# Altium schematic sheet power.SchDoc: Edison Gateway - Power
size Letter; Author: Ye-Sheng Kuo; DocumentNumber: 2; Revision: 3; SheetNumber: 2; SheetTotal: 10
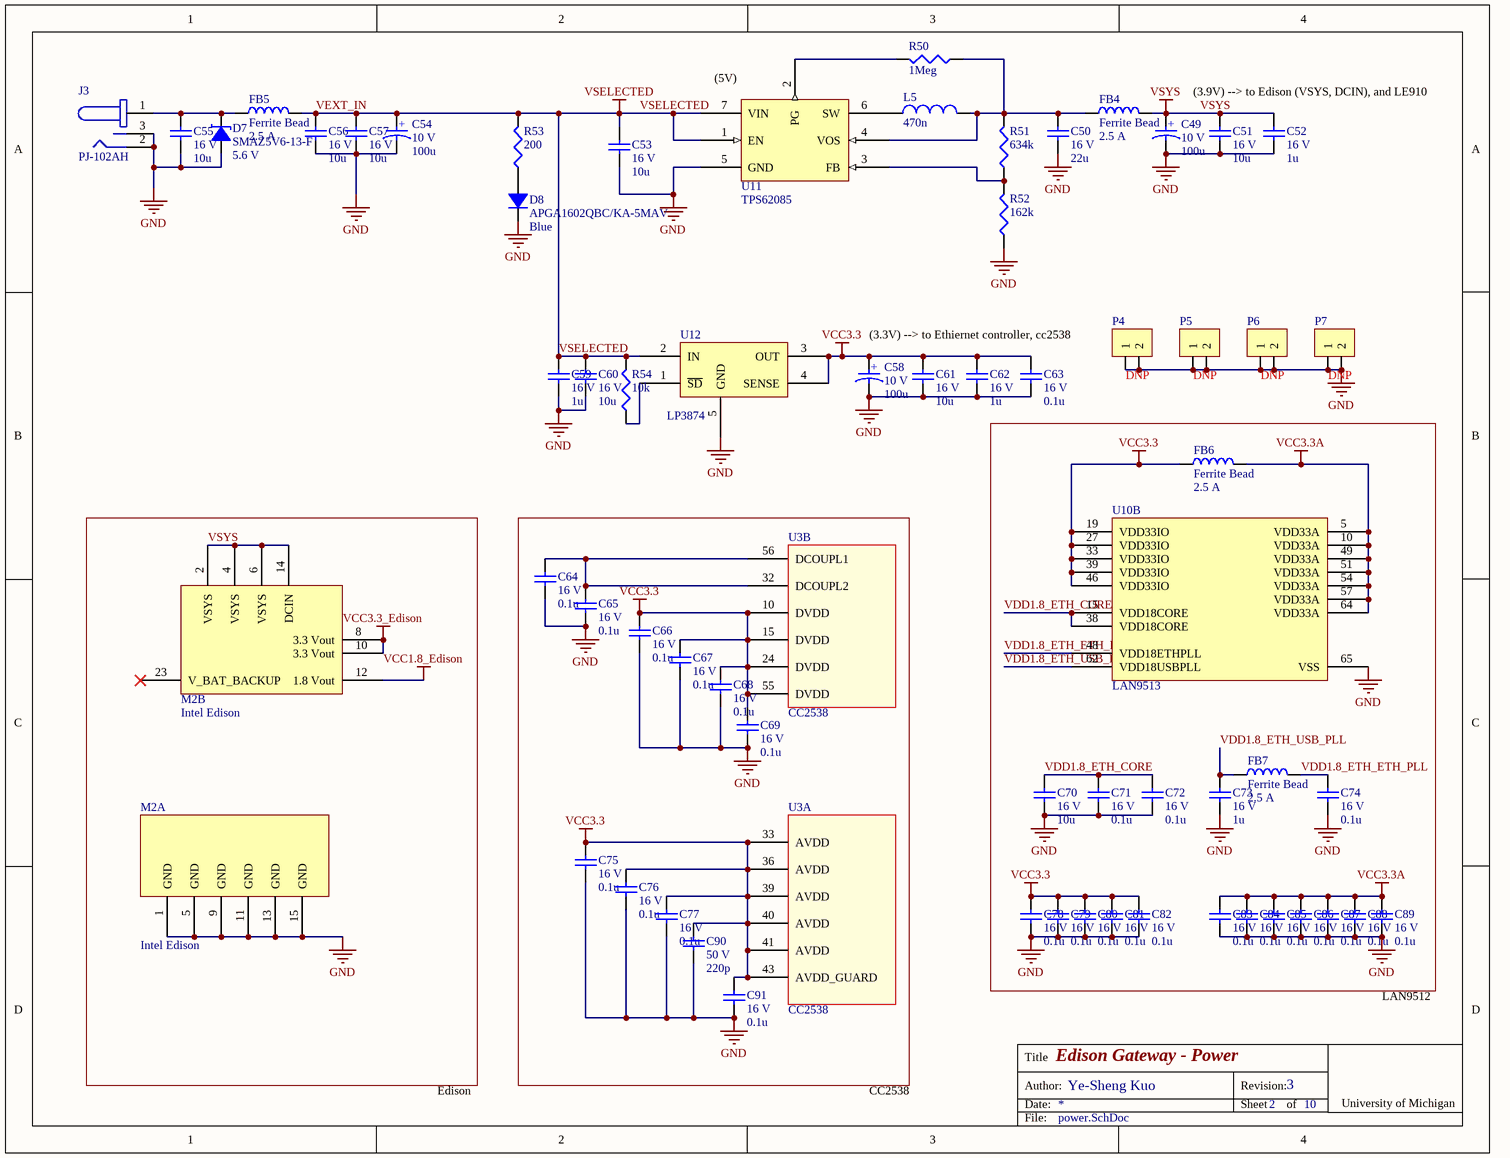
[diagram p0: power.SchDoc]

## Parts
C49  voltage rated: 10 V  [1206 - POLAR MARKING]  (hidden comment: 100u)
C50  voltage rated: 16 V  [1206]  (hidden comment: 22u)
C51  voltage rated: 16 V  [0603]  (hidden comment: 10u)
C52  voltage rated: 16 V  [0402]  (hidden comment: 1u)
C53  voltage rated: 16 V  [0603]  (hidden comment: 10u)
C54  voltage rated: 10 V  [1206 - POLAR MARKING]  (hidden comment: 100u)
C55  voltage rated: 16 V  [0603]  (hidden comment: 10u)
C56  voltage rated: 16 V  [0603]  (hidden comment: 10u)
C57  voltage rated: 16 V  [0603]  (hidden comment: 10u)
C58  voltage rated: 10 V  [1206 - POLAR MARKING]  (hidden comment: 100u)
C59  voltage rated: 16 V  [0402]  (hidden comment: 1u)
C60  voltage rated: 16 V  [0603]  (hidden comment: 10u)
C61  voltage rated: 16 V  [0603]  (hidden comment: 10u)
C62  voltage rated: 16 V  [0402]  (hidden comment: 1u)
C63  voltage rated: 16 V  [0402]  (hidden comment: 0.1u)
C64  voltage rated: 16 V  [0402]  (hidden comment: 0.1u)
C65  voltage rated: 16 V  [0402]  (hidden comment: 0.1u)
C66  voltage rated: 16 V  [0402]  (hidden comment: 0.1u)
C67  voltage rated: 16 V  [0402]  (hidden comment: 0.1u)
C68  voltage rated: 16 V  [0402]  (hidden comment: 0.1u)
C69  voltage rated: 16 V  [0402]  (hidden comment: 0.1u)
C70  voltage rated: 16 V  [0603]  (hidden comment: 10u)
C71  voltage rated: 16 V  [0402]  (hidden comment: 0.1u)
C72  voltage rated: 16 V  [0402]  (hidden comment: 0.1u)
C73  voltage rated: 16 V  [0402]  (hidden comment: 1u)
C74  voltage rated: 16 V  [0402]  (hidden comment: 0.1u)
C75  voltage rated: 16 V  [0402]  (hidden comment: 0.1u)
C76  voltage rated: 16 V  [0402]  (hidden comment: 0.1u)
C77  voltage rated: 16 V  [0402]  (hidden comment: 0.1u)
C78  voltage rated: 16 V  [0402]  (hidden comment: 0.1u)
C79  voltage rated: 16 V  [0402]  (hidden comment: 0.1u)
C80  voltage rated: 16 V  [0402]  (hidden comment: 0.1u)
C81  voltage rated: 16 V  [0402]  (hidden comment: 0.1u)
C82  voltage rated: 16 V  [0402]  (hidden comment: 0.1u)
C83  voltage rated: 16 V  [0402]  (hidden comment: 0.1u)
C84  voltage rated: 16 V  [0402]  (hidden comment: 0.1u)
C85  voltage rated: 16 V  [0402]  (hidden comment: 0.1u)
C86  voltage rated: 16 V  [0402]  (hidden comment: 0.1u)
C87  voltage rated: 16 V  [0402]  (hidden comment: 0.1u)
C88  voltage rated: 16 V  [0402]  (hidden comment: 0.1u)
C89  voltage rated: 16 V  [0402]  (hidden comment: 0.1u)
C90  voltage rated: 50 V  [0402]  (hidden comment: 220p)
C91  voltage rated: 16 V  [0402]  (hidden comment: 0.1u)
D7  SMAZ5V6-13-F  Zener Voltage: 5.6 V  [SMAZ5V1]
D8  APGA1602QBC/KA-5MAV  value Blue  [APGA1602]
FB4  Ferrite Bead  Current Rating (Max): 2.5 A  [0603]
FB5  Ferrite Bead  Current Rating (Max): 2.5 A  [0603]
FB6  Ferrite Bead  Current Rating (Max): 2.5 A  [0603]
FB7  Ferrite Bead  Current Rating (Max): 2.5 A  [0603]
J3  PJ-102AH  [PJ-102AH]
L5  470n  [74404300047]
M2  Intel Edison  [Intel Edison mating]  (parts A,B of 5)
P4  Note: DNP  [1x2 header]  (hidden comment: 1 x 2 header)
P5  Note: DNP  [1x2 header]  (hidden comment: 1 x 2 header)
P6  Note: DNP  [1x2 header]  (hidden comment: 1 x 2 header)
P7  Note: DNP  [1x2 header]  (hidden comment: 1 x 2 header)
R50  1Meg  [0402]
R51  634k  [0402]
R52  162k  [0402]
R53  200  [0402]
R54  10k  [0402]
U3  CC2538  [QFN56]  (parts A,B of 6)
U10  LAN9513  [QFN-64]  (part B of 5)
U11  TPS62085  [VSON]
U12  LP3874  [SOT150P700X180-5N]

## Nets
GND: C49.2 C50.2 C51.2 C52.2 C53.2 C54.2 C55.2 C56.2 C57.2 C58.2 C59.2 C60.2 C61.2 C62.2 C63.2 C64.2 C65.2 C66.2 C67.2 C68.2 C69.2 C70.2 C71.2 C72.2 C73.2 C74.2 C75.2 C76.2 C77.2 C78.2 C79.2 C80.2 C81.2 C82.2 C83.2 C84.2 C85.2 C86.2 C87.2 C88.2 C89.2 C90.2 C91.2 D7.1 D8.2 J3.2 J3.3 M2.1(GND) M2.5(GND) M2.9(GND) M2.11(GND) M2.13(GND) M2.15(GND) P4.1 P4.2 P5.1 P5.2 P6.1 P6.2 P7.1 P7.2 R52.2 U10.65(VSS) U11.5(GND) U12.5(GND)
VCC1.8_Edison: M2.12(1.8_Vout)
VCC3.3: C58.1 C61.1 C62.1 C63.1 C66.1 C67.1 C68.1 C69.1 C75.1 C76.1 C77.1 C78.1 C79.1 C80.1 C81.1 C82.1 C90.1 C91.1 FB6.2 U3.10(DVDD) U3.15(DVDD) U3.24(DVDD) U3.33(AVDD) U3.36(AVDD) U3.39(AVDD) U3.40(AVDD) U3.41(AVDD) U3.43(AVDD_GUARD) U3.55(DVDD) U10.19(VDD33IO) U10.27(VDD33IO) U10.33(VDD33IO) U10.39(VDD33IO) U10.46(VDD33IO) U12.3(OUT) U12.4(SENSE)
VCC3.3_Edison: M2.8(3.3_Vout) M2.10(3.3_Vout)
VCC3.3A: C83.1 C84.1 C85.1 C86.1 C87.1 C88.1 C89.1 FB6.1 U10.5(VDD33A) U10.10(VDD33A) U10.49(VDD33A) U10.51(VDD33A) U10.54(VDD33A) U10.57(VDD33A) U10.64(VDD33A)
VEXT_IN: C53.1 C54.1 C56.1 C57.1 C59.1 C60.1 FB5.1 R53.1 R54.1 U11.1(EN) U11.7(VIN) U12.2(IN)  [also labelled VSELECTED]
VSYS: C49.1 C51.1 C52.1 FB4.1 M2.2(VSYS) M2.4(VSYS) M2.6(VSYS) M2.14(DCIN)
VDD1.8_ETH_CORE: C70.1 C71.1 C72.1 U10.15(VDD18CORE) U10.38(VDD18CORE)
VDD1.8_ETH_ETH_PLL: C74.1 FB7.1 U10.48(VDD18ETHPLL)
VDD1.8_ETH_USB_PLL: C73.1 FB7.2 U10.62(VDD18USBPLL)
NetC50_1: C50.1 FB4.2 L5.1 R50.2 R51.1 U11.4(VOS)
NetC55_1: C55.1 D7.2 FB5.2 J3.1
NetC64_1: C64.1 C65.1 U3.32(DCOUPL2) U3.56(DCOUPL1)
NetD8_1: D8.1 R53.2
NetL5_2: L5.2 U11.6(SW)
NetR50_1: R50.1 U11.2(PG)
NetR51_2: R51.2 R52.1 U11.3(FB)
NetR54_2: R54.2 U12.1(~{SD})

Not connected (* = marked no-connect by the designer): M2 23(V_BAT_BACKUP)*

## Notes on the sheet
- (near U11) (5V)
- (3.9V) --> to Edison (VSYS, DCIN), and LE910
- (near P4) (3.3V) --> to Ethiernet controller, cc2538
- LAN9512
- Edison
- CC2538
- Title
- Date:
- Author:
- Revision:
- Sheet
- of
- University of Michigan
- File:
- (in symbol TLNK107M010R2500) +

## Library data of the parts
C49 C54 C58 = TLNK107M010R2500: 100µF ±20% Molded Tantalum Capacitors 10V 1206; Manufacture: AVX; ESR: 2.5 Ohm; tolerance: 20%; package: 1206; Supplier 1: Digi-Key; Supplier Part Number 1: 478-6251-1-ND; Value: 100u; Manufacturer Part Number: TLNK107M010R2500
C50 = CL31A226MOCLNNC: 22µF ±20% 16V Ceramic Capacitor X5R 1206; Manufacture: Samsung; tolerance: 20%; package: 1206; Supplier 1: Digi-Key; Supplier Part Number 1: 1276-2728-1-ND; Value: 22u; Temperature Coefficient: X5R; Manufacturer Part Number: CL31A226MOCLNNC
C51 C53 C55-C57 C60 C61 C70 = GRM188C81C106MA73D: 10µF ±20% 16V Ceramic Capacitor X6S 0603; Manufacture: Murata; tolerance: 20%; package: 0603; Temperature Coefficient: X6S; Supplier 1: Digi-Key; Supplier Part Number 1: 490-7198-1-ND; Value: 10u; Manufacturer Part Number: GRM188C81C106MA73D
C52 C59 C62 C73 = C1005X6S1C105K050BC: 1µF ±10% 16V Ceramic Capacitor X6S 0402; Manufacture: TDK; tolerance: 10%; package: 0402; Supplier 1: Digi-Key; Supplier Part Number 1: 445-9086-1-ND; Value: 1u; Temperature Coefficient: X6S; Manufacturer Part Number: C1005X6S1C105K050BC
C63-C69 C71 C72 C74-C89 C91 = GRM155R71C104KA88D: 0.10µF ±10% 16V Ceramic Capacitor X7R 0402; Manufacture: Murata; tolerance: 10%; package: 0402; Supplier 1: Digi-Key; Supplier Part Number 1: 490-3261-1-ND; Value: 0.1u; Temperature Coefficient: X7R; Manufacturer Part Number: GRM155R71C104KA88D
C90 = C0402C221K5RACTU: 220pF ±10% 50V Ceramic Capacitor X7R 0402; Manufacture: Kemet; tolerance: 10%; package: 0402; Supplier 1: Digi-Key; Supplier Part Number 1: 399-1030-1-ND; Value: 220p; Temperature Coefficient: X7R; Manufacturer Part Number: C0402C221K5RACTU
D7 = SMAZ5V6-13-F: Zener Diode 5.6V 1W ±5% Surface Mount SMA; Manufacturer: Diodes Incorporated; reverse current: 5 uA @ 2 V; Manufacturer Part Number: SMAZ5V6-13-F; diode type: Zener; Supplier 1: Digi-Key; Supplier Part Number 1: SMAZ5V6-FDICT-ND; power: 1 W
D8 = APGA1602QBC/KA-5MAV: Blue 463nm LED Indication - Discrete 2.8V 2-SMD; Manufacturer: Kingbright; Current @ VF: 5 mA; Forward Voltage: 2.8 V; Manufacturer Part Number: APGA1602QBC/KA-5MAV; Wavelength: 463 nm; Supplier 1: Digi-Key; Supplier Part Number 1: 754-1821-1-ND
FB4-FB7 = BLM18SG221TN1D: FERRITE BEAD 220 OHM 0603; Manufacturer: Murata; DC resistance: 40m; Impedance @ Frequency: 220 Ohm @ 100MHz; package: 0603; Supplier 1: Digi-Key; Supplier Part Number 1: 490-5225-1-ND; Manufacturer Part Number: BLM18SG221TN1D
J3 = PJ-102AH: CONN PWR JACK 2.1X5.5MM HIGH CUR; Supplier 1: Digi-Key; Supplier Part Number 1: CP-102AH-ND
L5 = 74404300047: 470nH Shielded Wirewound Inductor 3.8A 16 mOhm Max 1919 (4848 Metric); Manufacturer: Wurth Electronics Inc; tolerance: 30%; DCR (Max): 16m; Supplier 1: Digi-Key; Supplier Part Number 1: 732-4087-1-ND; Value: 470n; Current Rating: 3.8 A; Manufacturer Part Number: 74404300047
M2 = Intel Edison: Note: Mating connector: H124603CT-ND
P4-P7 = 1 x 2 header: 100 mils standard header; Supplier 1: Digi-Key; Supplier Part Number 1: 3M9447-ND
R50 = CRCW04021M00FKED: RES SMD 1M OHM 1% 1/16W 0402; Manufacturer: Vishay Dale; Temperature Coefficient: 100 ppm/C; Tolerance: 1%; Power: 1/16 W; Supplier 1: Digi-Key; Supplier Part Number 1: 541-1.00MLCT-ND; package: 0402; value: 1Meg; Manufacturer Part Number: CRCW04021M00FKED
R51 = CRCW0402634KFKED: RES SMD 634K OHM 1% 1/16W 0402; Manufacturer: Vishay Dale; Temperature Coefficient: 100 ppm/C; Tolerance: 1%; Power: 1/16 W; package: 0402; Supplier 1: Digi-Key; Supplier Part Number 1: 541-634KLCT-ND; value: 634k; Manufacturer Part Number: CRCW0402634KFKED
R52 = CRCW0402162KFKED: RES SMD 162K OHM 1% 1/16W 0402; Manufacturer: Vishay Dale; Temperature Coefficient: 100 ppm/C; Tolerance: 1%; Power: 1/16 W; package: 0402; Supplier 1: Digi-Key; Supplier Part Number 1: 541-162KLCT-ND; value: 162k; Manufacturer Part Number: CRCW0402162KFKED
R53 = CRCW0402200RFKED: RES SMD 200 OHM 1% 1/16W 0402; Manufacturer: Vishay Dale; Temperature Coefficient: 100 ppm/C; Tolerance: 1%; Power: 1/16 W; package: 0402; Supplier 1: Digi-Key; Supplier Part Number 1: 541-200LCT-ND; value: 200; Manufacturer Part Number: CRCW0402200RFKED
R54 = CRCW040210K0FKED: RES SMD 10K OHM 1% 1/16W 0402; Manufacturer: Vishay Dale; Temperature Coefficient: 100 ppm/C; Tolerance: 1%; Power: 1/16 W; package: 0402; Supplier 1: Digi-Key; Supplier Part Number 1: 541-10.0KLCT-ND; value: 10k; Manufacturer Part Number: CRCW040210K0FKED
U3 = CC2538: A Powerful System-On-Chip for 2.4-GHz IEEE 802.15.4, 6LoWPAN  and ZigBee Applications; Supplier 1: Digi-Key; Supplier Part Number 1: 296-35797-1-ND
U10 = LAN9513: USB 2.0 Hub and 10/100  Ethernet Controller; Supplier 1: Digi-Key; Supplier Part Number 1: LAN9513-JZX-ND
U11 = TPS62085: 3-A Step-Down Converter With Hiccup Short-Circuit Protection  In 2 × 2 QFN Package; Supplier 1: Digi-Key; Supplier Part Number 1: 296-40830-1-ND
U12 = LP3874: LP387x 0.8-A Fast Ultra-Low-Dropout Linear Regulators; Supplier 1: Digi-Key; Supplier Part Number 1: LP3874EMP-3.3/NOPBCT-ND